# Altium schematic sheet 9-Axis.SchDoc
size A4; SheetNumber: 2
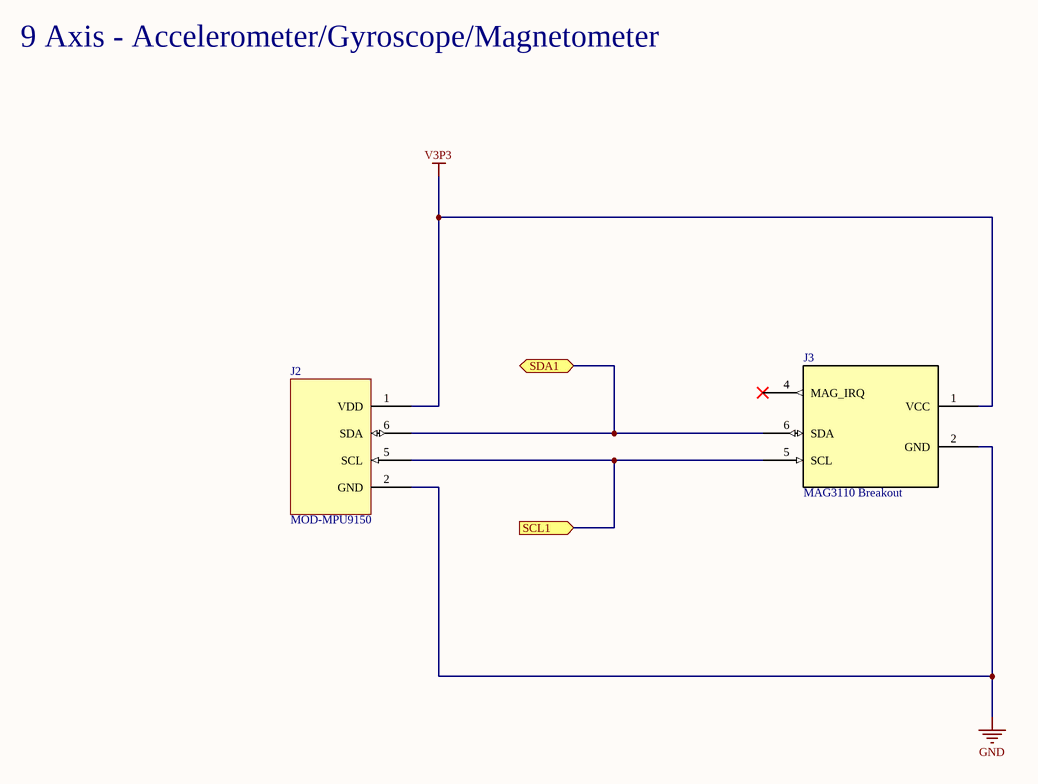
[diagram p0: 9-Axis.SchDoc]

## Parts
J2  MOD-MPU9150  [UEXT_MALE x10]
J3  MAG3110 Breakout  [UEXT_MALE x10]

## Ports
SCL1 (in), SDA1 (bidir)

## Nets
GND: J2.2(GND) J3.2(GND)
V3P3: J2.1(VDD) J3.1(VCC)
SCL1: J2.5(SCL) J3.5(SCL) ; port SCL1
SDA1: J2.6(SDA) J3.6(SDA) ; port SDA1

Not connected (* = marked no-connect by the designer): J3 4(MAG_IRQ)*

## Notes on the sheet
- 9 Axis - Accelerometer/Gyroscope/Magnetometer

## Library data of the parts
J2 = MOD-MPU9150: 9-Axis; Fabricant: AMP - TE Connectivy; RefFabricant: 5103310-1; Fournisseur: Farnell; RefFournisseur: 2452436
J3 = MOD-MAG3110: Fournisseur: Farnell; RefFabricant: 5103310-1; Fabricant: AMP - TE Connectvity; RefFournisseur: 2452436